# Altium schematic sheet sensorPlate.SchDoc
size A3
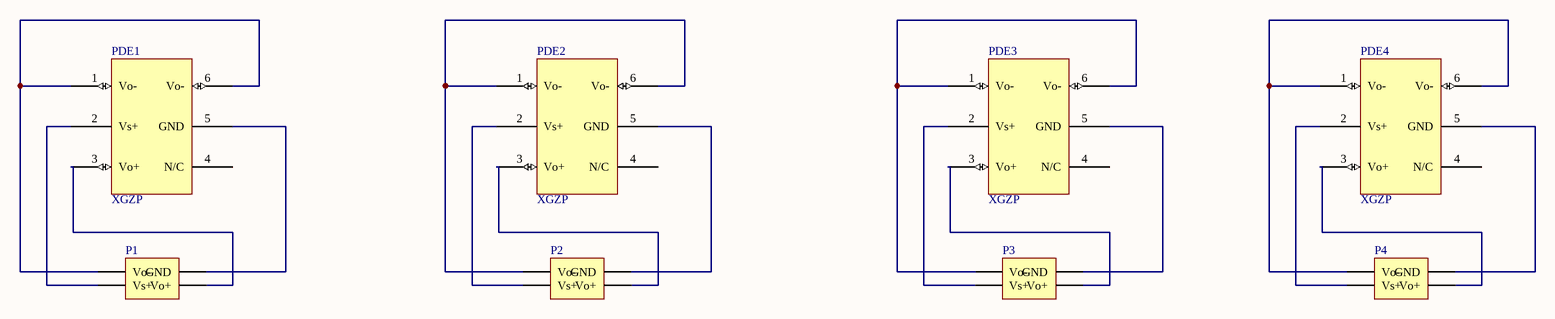
[diagram p0: sensorPlate.SchDoc]

## Parts
P1  Header 2X2  [HDR2X2]  (value not drawn)
P2  Header 2X2  [HDR2X2]  (value not drawn)
P3  Header 2X2  [HDR2X2]  (value not drawn)
P4  Header 2X2  [HDR2X2]  (value not drawn)
PDE1  XGZP  [XGZP_Footprint]
PDE2  XGZP  [XGZP_Footprint]
PDE3  XGZP  [XGZP_Footprint]
PDE4  XGZP  [XGZP_Footprint]

## Nets
NetP1_1: P1.1(Vo+) PDE1.3(Vo+)
NetP1_2: P1.2(Vs+) PDE1.2(Vs+)
NetP1_3: P1.3(GND) PDE1.5(GND)
NetP1_4: P1.4(Vo-) PDE1.1(Vo-) PDE1.6(Vo-)
NetP2_1: P2.1(Vo+) PDE2.3(Vo+)
NetP2_2: P2.2(Vs+) PDE2.2(Vs+)
NetP2_3: P2.3(GND) PDE2.5(GND)
NetP2_4: P2.4(Vo-) PDE2.1(Vo-) PDE2.6(Vo-)
NetP3_1: P3.1(Vo+) PDE3.3(Vo+)
NetP3_2: P3.2(Vs+) PDE3.2(Vs+)
NetP3_3: P3.3(GND) PDE3.5(GND)
NetP3_4: P3.4(Vo-) PDE3.1(Vo-) PDE3.6(Vo-)
NetP4_1: P4.1(Vo+) PDE4.3(Vo+)
NetP4_2: P4.2(Vs+) PDE4.2(Vs+)
NetP4_3: P4.3(GND) PDE4.5(GND)
NetP4_4: P4.4(Vo-) PDE4.1(Vo-) PDE4.6(Vo-)

Not connected (* = marked no-connect by the designer): PDE1 4(N/C); PDE2 4(N/C); PDE3 4(N/C); PDE4 4(N/C)

## Library data of the parts
P1-P4 = Header 2X2: Header, 2-Pin, Dual row; LatestRevisionDate: 17-Jul-2002; LatestRevisionNote: Re-released for DXP Platform.; Publisher: Altium Limited